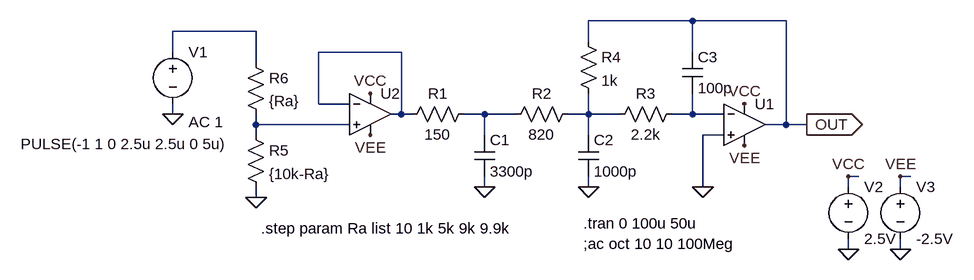
[diagram p0: schematic 3rd MFB with POT Buffer.asc]
3rd MFB with POT Buffer.asc, the LTspice schematic file:
Version 4
SHEET 1 1100 680
WIRE 688 0 528 0
WIRE 832 0 688 0
WIRE 16 16 -112 16
WIRE 528 32 528 0
WIRE -112 48 -112 16
WIRE 240 48 112 48
WIRE 688 48 688 0
WIRE 16 64 16 16
WIRE 112 128 112 48
WIRE 160 128 112 128
WIRE -112 144 -112 128
WIRE 240 144 240 48
WIRE 240 144 224 144
WIRE 256 144 240 144
WIRE 368 144 336 144
WIRE 416 144 368 144
WIRE 528 144 528 112
WIRE 528 144 496 144
WIRE 576 144 528 144
WIRE 688 144 688 112
WIRE 688 144 656 144
WIRE 736 144 688 144
WIRE 16 160 16 144
WIRE 160 160 16 160
WIRE 832 160 832 0
WIRE 832 160 800 160
WIRE 864 160 832 160
WIRE 16 176 16 160
WIRE 368 176 368 144
WIRE 528 176 528 144
WIRE 736 176 704 176
WIRE 944 240 928 240
WIRE 1024 240 1008 240
WIRE 368 256 368 240
WIRE 528 256 528 240
WIRE 704 256 704 176
WIRE 928 256 928 240
WIRE 1008 256 1008 240
WIRE 16 272 16 256
WIRE 928 352 928 336
WIRE 1008 352 1008 336
FLAG -112 144 0
FLAG 528 256 0
FLAG 704 256 0
FLAG 368 256 0
FLAG 16 272 0
FLAG 864 160 OUT
IOPIN 864 160 Out
FLAG 928 352 0
FLAG 1008 352 0
FLAG 928 240 VCC
FLAG 1008 240 VEE
FLAG 192 112 VCC
FLAG 768 128 VCC
FLAG 192 176 VEE
FLAG 768 192 VEE
SYMBOL voltage -112 32 R0
WINDOW 3 -234 158 Left 2
WINDOW 123 24 124 Left 2
WINDOW 39 0 0 Left 2
SYMATTR InstName V1
SYMATTR Value PULSE(-1 1 0 2.5u 2.5u 0 5u)
SYMATTR Value2 AC 1
SYMBOL res 512 128 R90
WINDOW 0 0 56 VBottom 2
WINDOW 3 32 56 VTop 2
SYMATTR InstName R2
SYMATTR Value 820
SYMBOL res 672 128 R90
WINDOW 0 0 56 VBottom 2
WINDOW 3 32 56 VTop 2
SYMATTR InstName R3
SYMATTR Value 2.2k
SYMBOL cap 512 176 R0
SYMATTR InstName C2
SYMATTR Value 1000p
SYMBOL res 512 16 R0
SYMATTR InstName R4
SYMATTR Value 1k
SYMBOL cap 672 48 R0
SYMATTR InstName C3
SYMATTR Value 100p
SYMBOL Opamps\\UniversalOpamp2 768 160 R0
SYMATTR InstName U1
SYMBOL cap 352 176 R0
SYMATTR InstName C1
SYMATTR Value 3300p
SYMBOL res 352 128 R90
WINDOW 0 0 56 VBottom 2
WINDOW 3 32 56 VTop 2
SYMATTR InstName R1
SYMATTR Value 150
SYMBOL res 0 160 R0
SYMATTR InstName R5
SYMATTR Value {10k-Ra}
SYMBOL res 0 48 R0
SYMATTR InstName R6
SYMATTR Value {Ra}
SYMBOL Opamps\\UniversalOpamp2 192 144 R0
SYMATTR InstName U2
SYMBOL voltage 928 240 R0
WINDOW 123 0 0 Left 2
WINDOW 39 0 0 Left 2
SYMATTR InstName V2
SYMATTR Value 2.5V
SYMBOL voltage 1008 240 R0
WINDOW 123 0 0 Left 2
WINDOW 39 0 0 Left 2
SYMATTR InstName V3
SYMATTR Value -2.5V
TEXT 520 344 Left 2 !;ac oct 10 10 100Meg
TEXT 520 312 Left 2 !.tran 0 100u 50u
TEXT 24 320 Left 2 !.step param Ra list 10 1k 5k 9k 9.9k

The netlist it stands for:
* 3rd MFB with POT Buffer.asc
V1 N001 0 PULSE(-1 1 0 2.5u 2.5u 0 5u) AC 1
R2 N004 N003 820
R3 N005 N004 2.2k
C2 N004 0 1000p
R4 OUT N004 1k
C3 OUT N005 100p
XU1 0 N005 VCC VEE OUT level.2 Avol=1Meg GBW=10Meg Slew=10Meg ilimit=25m rail=0 Vos=0 phimargin=45 en=0 enk=0 in=0 ink=0 Rin=500Meg  ; pins IN+ IN- V+ V- OUT
C1 N003 0 3300p
R1 N003 N002 150
R5 N006 0 {10k-Ra}
R6 N001 N006 {Ra}
XU2 N006 N002 VCC VEE N002 level.2 Avol=1Meg GBW=10Meg Slew=10Meg ilimit=25m rail=0 Vos=0 phimargin=45 en=0 enk=0 in=0 ink=0 Rin=500Meg  ; pins IN+ IN- V+ V- OUT
V2 VCC 0 2.5V
V3 VEE 0 -2.5V
;ac oct 10 10 100Meg
.tran 0 100u 50u
.step param Ra list 10 1k 5k 9k 9.9k
.lib UniversalOpamps2.sub
.backanno
.end